# Altium schematic sheet 4-LuxSensor.SCHDOC
size A4
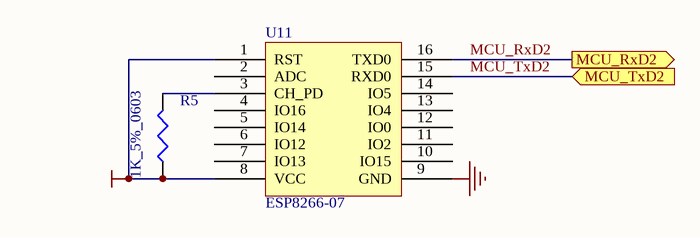
[diagram p0: 4-LuxSensor.SCHDOC]

## Parts
R5  1K_5%_0603  [C1608-0603]
U11  ESP8266-07  [ESP8266-07]

## Ports
MCU_RxD2 (out), MCU_TxD2 (in)

## Nets
GND: U11.9(GND)
VCC_3V3: R5.1 U11.1(RST) U11.8(VCC)
MCU_RxD2: U11.16(TXD0) ; port MCU_RxD2
MCU_TxD2: U11.15(RXD0) ; port MCU_TxD2
NetR5_2: R5.2 U11.3(CH_PD)

Not connected (* = marked no-connect by the designer): U11 2(ADC) 4(IO16) 5(IO14) 6(IO12) 7(IO13) 10(IO15) 11(IO2) 12(IO0) 13(IO4) 14(IO5)

## Library data of the parts
R5 = Res3: Resistor; Published: 8-Jun-2000; Revision: July-2002: Re-released for DXP Platform.; Publisher: Altium Limited